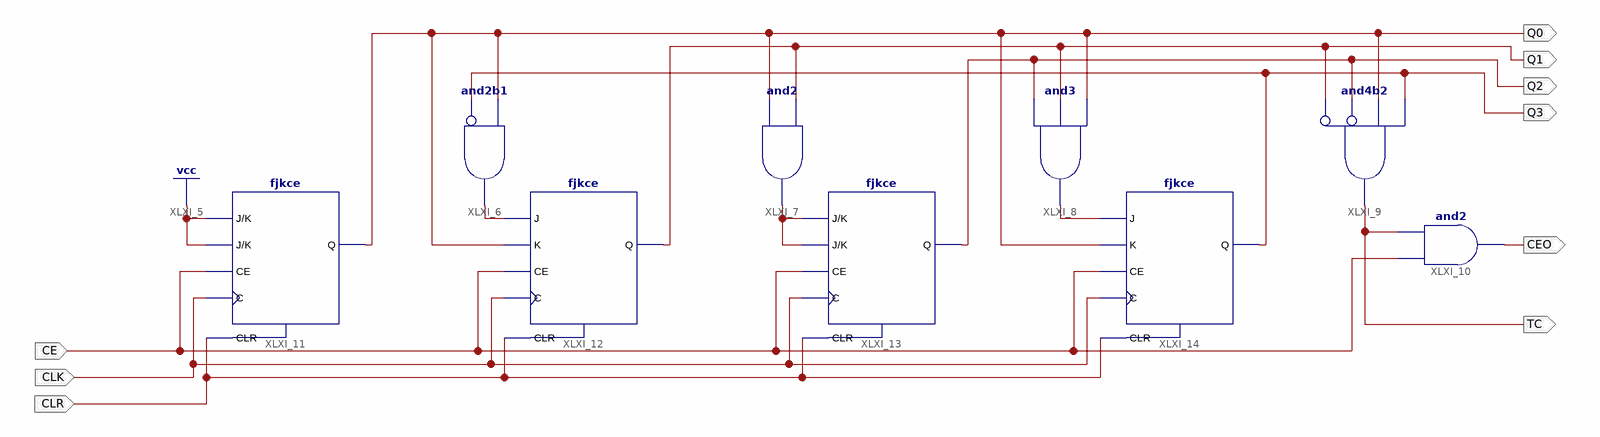
[diagram p0: schematic sheet 1]
// Xilinx ISE schematic counter10x4c.sch (spartan6) as structural Verilog: 9 symbols, 9 ports
module counter10x4c (
  input  CE,
  input  CLK,
  input  CLR,
  output Q3,
  output Q1,
  output Q2,
  output Q0,
  output CEO,
  output TC
);

  wire XLXN_6, XLXN_10, XLXN_16;

  and XLXI_6 (XLXN_6, ~Q3, Q0);  // and2b1
  and XLXI_7 (XLXN_10, Q0, Q1);
  and XLXI_8 (XLXN_16, Q2, Q1, Q0);
  and XLXI_9 (TC, ~Q1, ~Q2, Q0, Q3);  // and4b2
  and XLXI_10 (CEO, CE, TC);
  fjkce XLXI_11 (.C(CLK), .CE(CE), .CLR(CLR), .J(1'b1), .K(1'b1), .Q(Q0));
  fjkce XLXI_12 (.C(CLK), .CE(CE), .CLR(CLR), .J(XLXN_6), .K(Q0), .Q(Q1));
  fjkce XLXI_13 (.C(CLK), .CE(CE), .CLR(CLR), .J(XLXN_10), .K(XLXN_10), .Q(Q2));
  fjkce XLXI_14 (.C(CLK), .CE(CE), .CLR(CLR), .J(XLXN_16), .K(Q0), .Q(Q3));
endmodule
